# EAGLE design IP_m4_express (EAGLE 9.0.0)
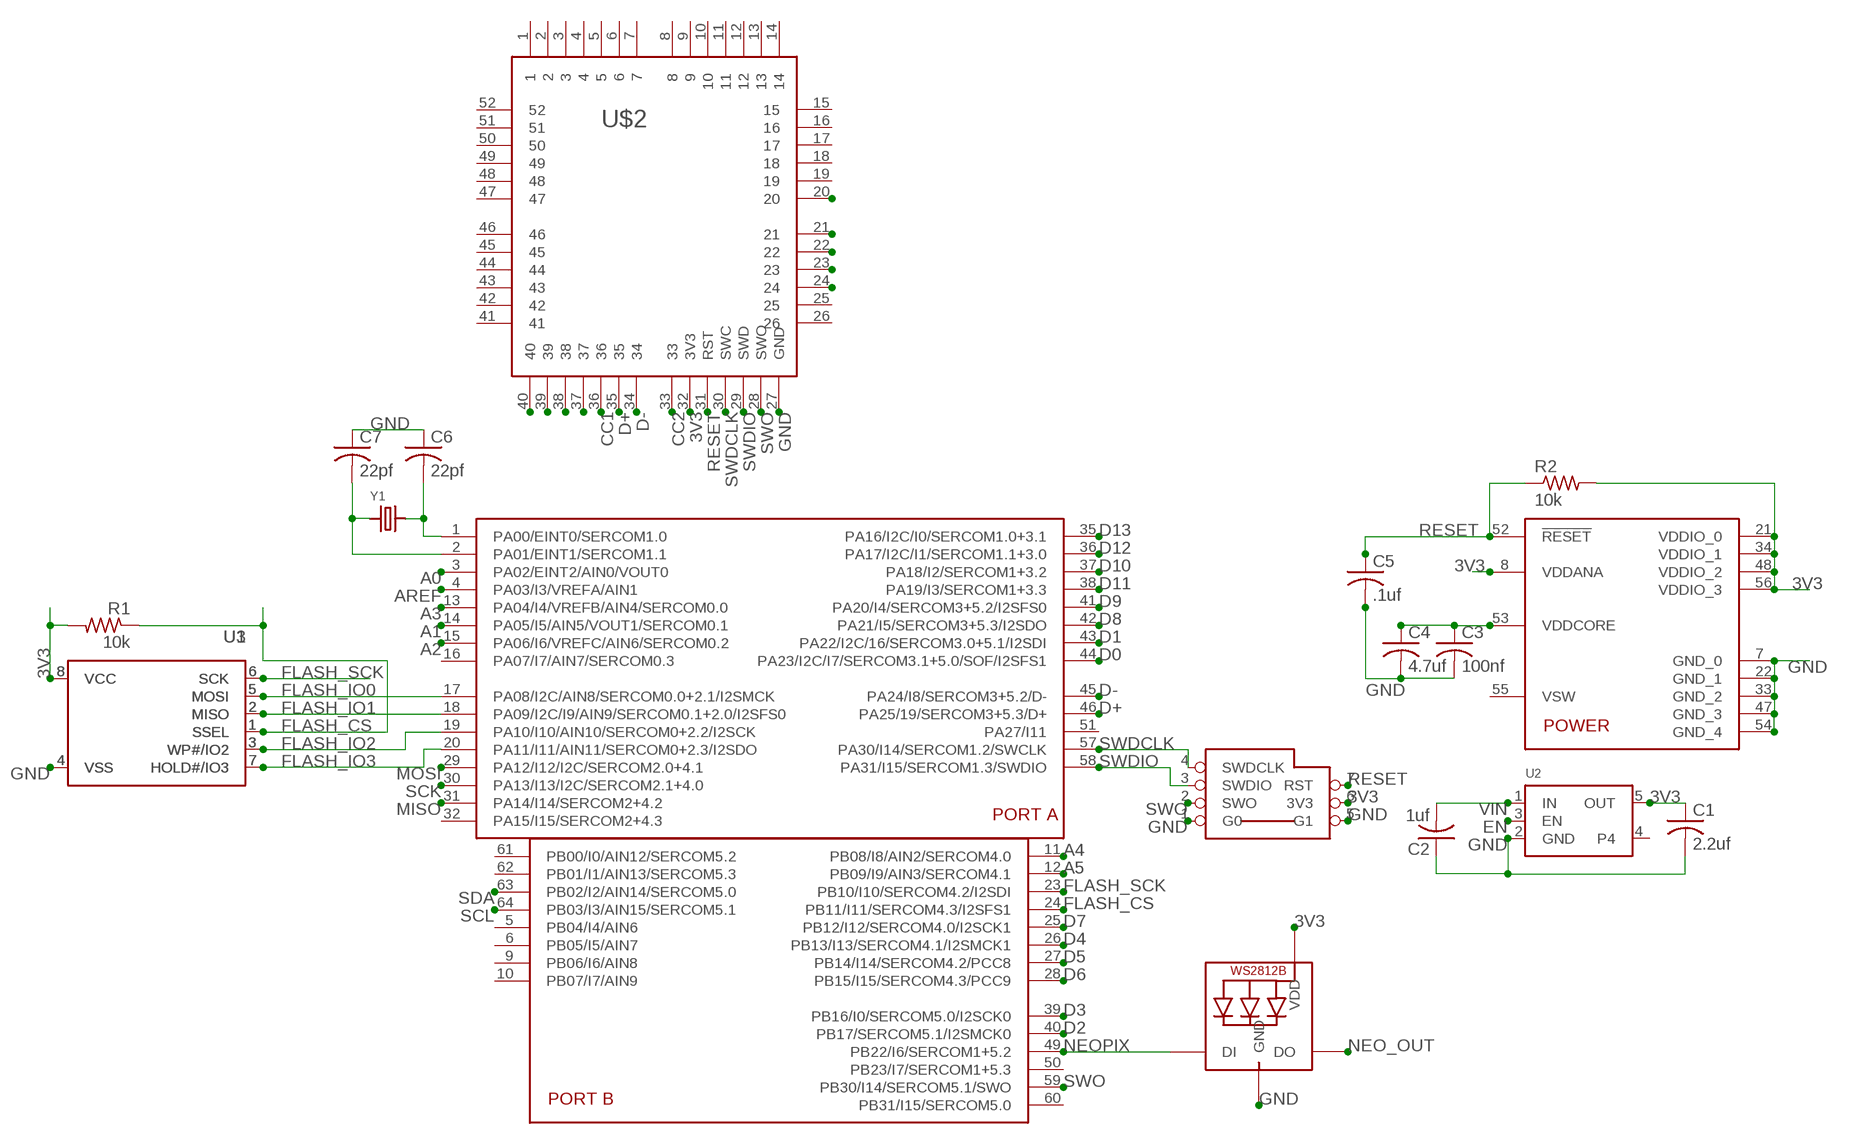
[diagram p0: schematic, sheet 1]

## Parts
C1  2.2uf  C-TG  [TG-C0805MP]
C2  1uf  C-TG  [TG-C0805MP]
C3  100nf  C-TG  [TG-C0805MP]
C4  4.7uf  C-TG  [TG-C0805MP]
C5  .1uf  C-TG  [TG-C0805MP]
C6  22pf  C-TG  [TG-C0805MP]
C7  22pf  C-TG  [TG-C0805MP]
LED1  LED-NEO-WS2812B3535  [LED3535]
R1  10k  R_TG  [TG-R0805]
R2  10k  R_TG  [TG-R0805]
U1  FLASH-SPI-SOIC8  [SOIC8_150MIL]
U2  VREG_STD_MIN_SOT23-5  [SOT23-5]
U3  FLASH-SPI-SOIC8208MIL  [SOIC8_208MIL]
U$1  MCU-ATSAMD51J-ADATQFP  [QFP50P1200X1200X120-64N]
U$2  DL_IP-52PACKAGE  [DL_IP-52_2MM-25X30-PACKAGE]
U$3  SWD_POGO  [SWD_POGO]
Y1  XTAL_ADA4.9X1.8  [MICROBUILDER_CRYSTAL_4.9X1.8]

## Nets
3V3: C1.1 LED1.2(VDD) R1.2 R2.2 U1.8(VCC) U2.5(OUT) U3.8(VCC) U$1.8(VDDANA) U$1.21(VDDIO_0) U$1.34(VDDIO_1) U$1.48(VDDIO_2) U$1.56(VDDIO_3) U$2.24 U$2.32(3V3) U$3.6(3V3)
A0: U$1.3(PA02/EINT2/AIN0/VOUT0)
A1: U$1.14(PA05/I5/AIN5/VOUT1/SERCOM0.1)
A2: U$1.15(PA06/I6/VREFC/AIN6/SERCOM0.2)
A3: U$1.13(PA04/I4/VREFB/AIN4/SERCOM0.0)
A4: U$1.11(PB08/I8/AIN2/SERCOM4.0)
A5: U$1.12(PB09/I9/AIN3/SERCOM4.1)
AREF: U$1.4(PA03/I3/VREFA/AIN1)
CC1: U$2.36
CC2: U$2.33
D0: U$1.44(PA23/I2C/I7/SERCOM3.1+5.0/SOF/I2SFS1)
D1: U$1.43(PA22/I2C/16/SERCOM3.0+5.1/I2SDI)
D2: U$1.40(PB17/SERCOM5.1/I2SMCK0)
D3: U$1.39(PB16/I0/SERCOM5.0/I2SCK0)
D4: U$1.26(PB13/I13/SERCOM4.1/I2SMCK1)
D5: U$1.27(PB14/I14/SERCOM4.2/PCC8)
D6: U$1.28(PB15/I15/SERCOM4.3/PCC9)
D7: U$1.25(PB12/I12/SERCOM4.0/I2SCK1)
D8: U$1.42(PA21/I5/SERCOM3+5.3/I2SDO)
D9: U$1.41(PA20/I4/SERCOM3+5.2/I2SFS0)
D10: U$1.37(PA18/I2/SERCOM1+3.2)
D11: U$1.38(PA19/I3/SERCOM1+3.3)
D12: U$1.36(PA17/I2C/I1/SERCOM1.1+3.0)
D13: U$1.35(PA16/I2C/I0/SERCOM1.0+3.1)
D+: U$1.46(PA25/19/SERCOM3+5.3/D+) U$2.35
D-: U$1.45(PA24/I8/SERCOM3+5.2/D-) U$2.34
EN: U2.3(EN)
FLASH_CS: R1.1 U1.1(SSEL) U3.1(SSEL) U$1.24(PB11/I11/SERCOM4.3/I2SFS1)
FLASH_IO0: U1.5(MOSI) U3.5(MOSI) U$1.17(PA08/I2C/AIN8/SERCOM0.0+2.1/I2SMCK)
FLASH_IO1: U1.2(MISO) U3.2(MISO) U$1.18(PA09/I2C/I9/AIN9/SERCOM0.1+2.0/I2SFS0)
FLASH_IO2: U1.3(WP#/IO2) U3.3(WP#/IO2) U$1.19(PA10/I10/AIN10/SERCOM0+2.2/I2SCK)
FLASH_IO3: U1.7(HOLD#/IO3) U3.7(HOLD#/IO3) U$1.20(PA11/I11/AIN11/SERCOM0+2.3/I2SDO)
FLASH_SCK: U1.6(SCK) U3.6(SCK) U$1.23(PB10/I10/SERCOM4.2/I2SDI)
GND: C1.2 C2.1 C3.2 C4.2 C5.2 C6.1 C7.1 LED1.4(GND) U1.4(VSS) U2.2(GND) U3.4(VSS) U$1.7(GND_0) U$1.22(GND_1) U$1.33(GND_2) U$1.47(GND_3) U$1.54(GND_4) U$2.27(GND) U$3.1(G0) U$3.5(G1)
MISO: U$1.31(PA14/I14/SERCOM2+4.2)
MOSI: U$1.29(PA12/I12/I2C/SERCOM2.0+4.1)
N$1: U$2.40
N$2: C7.2 U$1.2(PA01/EINT1/SERCOM1.1) Y1.1
N$3: C6.2 U$1.1(PA00/EINT0/SERCOM1.0) Y1.2
N$4: U$2.23
N$5: U$2.22
N$6: U$2.21
N$7: U$2.20
N$8: U$2.39
N$9: U$2.38
N$11: U$2.37
NEO_OUT: LED1.3(DO)
NEOPIX: LED1.1(DI) U$1.49(PB22/I6/SERCOM1+5.2)
RESET: C5.1 R2.1 U$1.52(!RESET) U$2.31(RST) U$3.7(RST)
SCK: U$1.30(PA13/I13/I2C/SERCOM2.1+4.0)
SCL: U$1.64(PB03/I3/AIN15/SERCOM5.1)
SDA: U$1.63(PB02/I2/AIN14/SERCOM5.0)
SWDCLK: U$1.57(PA30/I14/SERCOM1.2/SWCLK) U$2.30(SWC) U$3.4(SWDCLK)
SWDIO: U$1.58(PA31/I15/SERCOM1.3/SWDIO) U$2.29(SWD) U$3.3(SWDIO)
SWO: U$1.59(PB30/I14/SERCOM5.1/SWO) U$2.28(SWO) U$3.2(SWO)
VCORE: C3.1 C4.1 U$1.53(VDDCORE)
VIN: C2.2 U2.1(IN)
Unconnected: U2.4 U$1.5(PB04/I4/AIN6) U$1.6(PB05/I5/AIN7) U$1.9(PB06/I6/AIN8) U$1.10(PB07/I7/AIN9) U$1.16(PA07/I7/AIN7/SERCOM0.3) U$1.32(PA15/I15/SERCOM2+4.3) U$1.50(PB23/I7/SERCOM1+5.3) U$1.51(PA27/I11) U$1.55(VSW) U$1.60(PB31/I15/SERCOM5.0) U$1.61(PB00/I0/AIN12/SERCOM5.2) U$1.62(PB01/I1/AIN13/SERCOM5.3) U$2.1 U$2.2 U$2.3 U$2.4 U$2.5 U$2.6 U$2.7 U$2.8 U$2.9 U$2.10 U$2.11 U$2.12 U$2.13 U$2.14 U$2.15 U$2.16 U$2.17 U$2.18 U$2.19 U$2.25 U$2.26 U$2.41 U$2.42 U$2.43 U$2.44 U$2.45 U$2.46 U$2.47 U$2.48 U$2.49 U$2.50 U$2.51 U$2.52

## Library data of the parts
C1-C7 = 0TG-Lib v01.3:C-TG
LED1 = 0TG-Lib v01.3:LED-NEO-WS2812B: from: adafruit
R1 R2 = 0TG-Lib v01.3:R_TG
U1 U3 = 0TG-Lib v01.3:FLASH-SPI-SOIC8: SOIC8 SPI Flash Be careful with the size since SOIC8 flash comes in several 'widths' SOIC8 150 mil M25P16 - 16Mbit (2Mbit x 8) Serial Flash (75MHz SPI Bus), Supply: 2.7-3.6V Digikey: SOIC8 - M25P16-VMN6P-ND SOIC8 208 mil W25Q16BVSSIG - 16Mbit (2Mbit x 8) Serial Flash (104MHz SPI Bus), Supply: 2.7-3.6V Digikey: SOIC8 - W25Q16BVSSIG-ND from: adafruit availability low
U2 = 0TG-Lib v01.3:VREG_STD_MIN_SOT23-5: SOT23-5 Fixed Voltage Regulators from: adafruit Part Current Out V Out V In V Dropout θJA (°C/W) TJ (°C) Digikey Part No. ADP121 150mA 3.3V 3.4-5.5V 0.09V @ 150mA -- -- ADP121-AUJZ33R7CT-ND ADP121 150mA 3.0V 3.1-5.5V 0.09V @ 150mA -- -- ADP121-AUJZ30R7CT-ND ADP122 300mA 3.3V 3.4-5.5V 0.085V @ 300mA -- -- ADP122AUJZ-3.3-R7CT-ND ADP1712 300mA 3.3V 3.5-5.5V 0.17V @ 300mA -- -- ADP1712AUJZ-3.3-R7TR-ND AP7311 (Low Cost) 150mA 3.3V 3.5-6V 0.15V @ 150mA -- -- AP7311-33WG-7DICT-ND LD39015M18R 150mA 1.8V 1.9V-5.5V 0.08V @ 100mA -- -- 497-6977-1-ND LP2985A-33DBVR 150mA 3.3V 3.3-16V 0.28V @ 150mA 206 150 296-18479-1-ND MCP1824T-3302E/OT 300mA 3.3V 3.5V-6V 0.2V @ 300mA -- -- MCP1824T-3302E/OTCT-ND MIC5205-2.5YM5 TR 150mA 2.5V 2.7-16V 0.165V @ 150mA -- -- 576-1257-2-ND MIC5205-3.0YM5 TR 150mA 3.0V 3.2V-16V 0.165V @ 150mA -- -- 576-1258-2-ND MIC5205-3.3YM5 TR 150mA 3.3V 3.5V-16V 0.165V @ 150mA -- -- 576-1259-2-ND TPS780330220 150mA 3.3V+2.2V 3.6-5.5V 250mV Max -- -- 296-23332-1-ND TDA3663/N1,135 100mA 3.3V 3.5-45V 0.18V @ 50mA -- -- 568-5343-1-ND Max operating temp can be calculated using θJA, TJ (max junction temperature), and power in watts. Set the "Maximum Ambient Temperature" until it reaches TJ ("Max Junction Temperature"), which is the absolute limit for safe use of the regulator: Heat Sink Temperature Calculator <http://www.daycounter.com/Calculators/Heat-Sink-Temperature-Calculator.phtml> For example, With 12V source into a 3.3V LP2985 and a 30mA load, we are dissipating (12V-3.3V) * 0.03A = 0.261W. With a θJA of 206 °C/W, a TJ of 150°C, and 261mW we can safely use the chip without a heat sink up to 75°C (=147.1°C Junction Temperature).
U$1 = 0TG-Lib v01.3:MCU-ATSAMD51J-ADA: ATSAMD51J cortex m4 microcontroller from: adafruit altered: TG-Techie
U$2 = 0TG-Lib v01.3:DL_IP-52
U$3 = board packages dev:SWD_POGO
Y1 = 0TG-Lib v01.3:XTAL_ADA: Crystals HC49UP - Surface Mount Crystal 4.0MHz 18pF +/-30ppm Surface Mount Crystal [Digikey: 535-9857-1-ND] 12.0 MHz Surface Mount Crystal [Digikey: 535-9869-6-ND] 25.0 MHz Surface Mount Crystal [Digikey: 535-9078-1-ND] 2.5 x 2.0mm - MEMs SMT Crystal 16.0 MHz 10pF 20ppm 2.5 x 2.0mm Crystal [Digikey -40-85°C: 535-10923-1-ND] 3.2 x 2.5mm - MEMs SMT Crystal 12.0 MHz 8pF 15ppm 3.2 x 2.5mm Crystal [Digikey: -10-70°C: 644-1047-1-ND -40-125°C: 644-1128-1-ND] 16.0 MHz 8pF 15ppm 3.2 x 2.5mm Crystal [Digikey: -10-70°C: 644-1049-1-ND -40-125°C: 644-1129-2-ND] 16.0 MHz 10pF 10ppm 3.2 x 2.5mm Crystal [Digikey: 644-1100-1-ND] 27.12 MHz 18pF 30ppm 3.2 x 2.5mm Crystal [Digikey: 887-1424-1-ND] 27.12MHz 10pF 10ppm 3.2 x 2.5mm Crystal [Digikey: 887-1329-1-ND] 4.9 x 1.8mm - MEMs SMT Crystal 32.768 KHz 12.5pF 20ppm 4.9 x 1.8mm Crystal [Digikey: SE2415CT-ND] 8.0 x 3.8mm - Surface Mount Crystal 32.768kHz 12.5pF 20ppm -40°C-85°C [Digikey: 535-9166-2-ND] Cylinder 32.768KHz Cylinder Crystal (2x6mm body) [Ex. Digikey: 300-8341-2-ND]

## Board
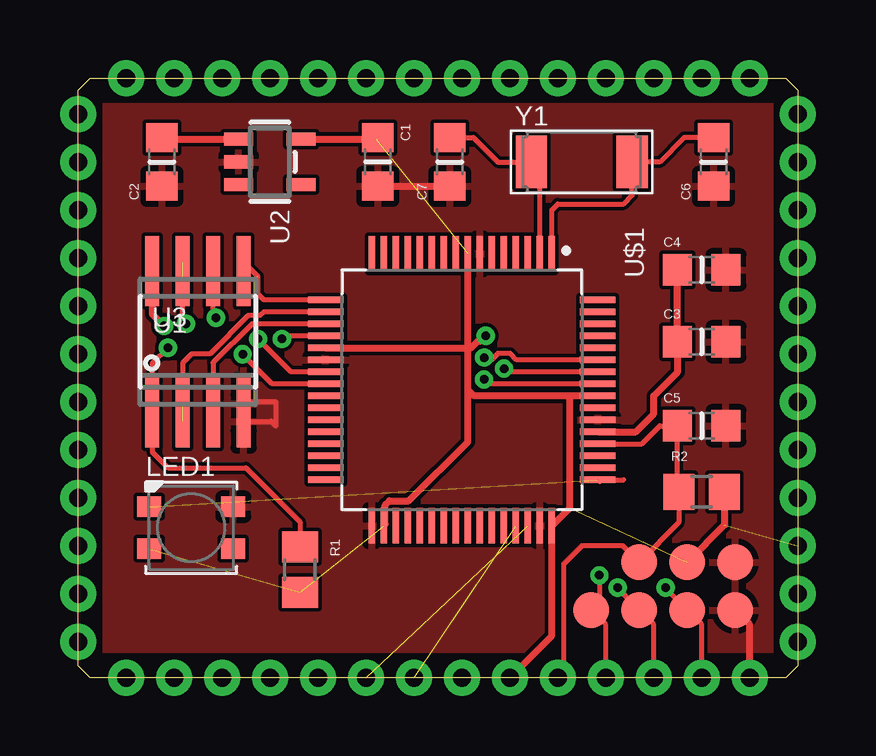
[diagram p1: board, top side]
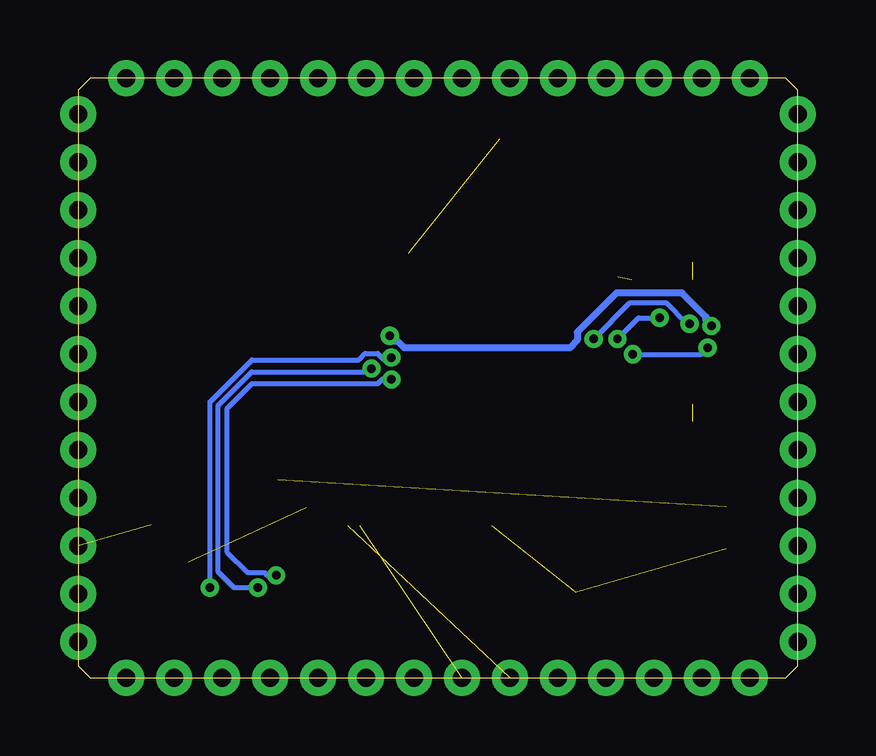
[diagram p2: board, bottom side, seen from below]

Size 30 x 25 mm. Coordinates in mm from the lower left corner, seen from the top.
Copper layers (1*16): Top 0.035mm / dielectric 1.5mm / Bottom 0.035mm
Design rules "default": minimum track width 6mil, minimum drill 0.35mm, track to track 6mil, track to pad 6mil, pad to pad 6mil, via to via 6mil, smd to smd 6mil, copper to edge 40mil, drill to drill 6mil, minimum pad ring 10mil, minimum via ring 8mil, stop-mask expansion 4mil, vias tented up to drill 0mil, thermal gap 10mil

### Footprints (pad centres in the part's own frame; a part is rotated, then mirrored left to right if it is on the bottom)
TG-C0805MP = smd 1.2 x 1.3: 1 -1.016,0; 2 1.016,0
LED3535 = smd 1 x 0.85: 1 -1.75,0.875; 2 -1.75,-0.875; 3 1.75,-0.875; 4 1.75,0.875
TG-R0805 = smd 1.3 x 1.5: 1 -0.95,0; 2 0.95,0
SOIC8_150MIL = smd 0.6 x 2.2: 1 -1.905,-2.6; 2 -0.635,-2.6; 3 0.635,-2.6; 4 1.905,-2.6; 5 1.905,2.6; 6 0.635,2.6; 7 -0.635,2.6; 8 -1.905,2.6
SOT23-5 = smd 0.55 x 1.2: 1 -0.95,-1.3; 2 0,-1.3; 3 0.95,-1.3; 4 0.95,1.3; 5 -0.95,1.3
SOIC8_208MIL = smd 0.6 x 2.2: 1 -1.905,-3.315; 2 -0.635,-3.315; 3 0.635,-3.315; 4 1.905,-3.315; 5 1.905,3.315; 6 0.635,3.315; 7 -0.635,3.315; 8 -1.905,3.315
QFP50P1200X1200X120-64N = smd 1.47 x 0.28: 1 -5.67,3.75; 2 -5.67,3.25; 3 -5.67,2.75; 4 -5.67,2.25; 5 -5.67,1.75; 6 -5.67,1.25; 7 -5.67,0.75; 8 -5.67,0.25; 9 -5.67,-0.25; 10 -5.67,-0.75; 11 -5.67,-1.25; 12 -5.67,-1.75; 13 -5.67,-2.25; 14 -5.67,-2.75; 15 -5.67,-3.25; 16 -5.67,-3.75; 33 5.67,-3.75; 34 5.67,-3.25; 35 5.67,-2.75; 36 5.67,-2.25; 37 5.67,-1.75; 38 5.67,-1.25; 39 5.67,-0.75; 40 5.67,-0.25; 41 5.67,0.25; 42 5.67,0.75; 43 5.67,1.25; 44 5.67,1.75; 45 5.67,2.25; 46 5.67,2.75; 47 5.67,3.25; 48 5.67,3.75 | smd 0.28 x 1.47: 17 -3.75,-5.67; 18 -3.25,-5.67; 19 -2.75,-5.67; 20 -2.25,-5.67; 21 -1.75,-5.67; 22 -1.25,-5.67; 23 -0.75,-5.67; 24 -0.25,-5.67; 25 0.25,-5.67; 26 0.75,-5.67; 27 1.25,-5.67; 28 1.75,-5.67; 29 2.25,-5.67; 30 2.75,-5.67; 31 3.25,-5.67; 32 3.75,-5.67; 49 3.75,5.67; 50 3.25,5.67; 51 2.75,5.67; 52 2.25,5.67; 53 1.75,5.67; 54 1.25,5.67; 55 0.75,5.67; 56 0.25,5.67; 57 -0.25,5.67; 58 -0.75,5.67; 59 -1.25,5.67; 60 -1.75,5.67; 61 -2.25,5.67; 62 -2.75,5.67; 63 -3.25,5.67; 64 -3.75,5.67
DL_IP-52_2MM-25X30-PACKAGE = drill 0.75 pad 1.5: 1 -13,12.5; 2 -11,12.5; 3 -9,12.5; 4 -7,12.5; 5 -5,12.5; 6 -3,12.5; 7 -1,12.5; 8 1,12.5; 9 3,12.5; 10 5,12.5; 11 7,12.5; 12 9,12.5; 13 11,12.5; 14 13,12.5; 15 15,11; 16 15,9; 17 15,7; 18 15,5; 19 15,3; 20 15,1; 21 15,-1; 22 15,-3; 23 15,-5; 24 15,-7; 25 15,-9; 26 15,-11; 27 13,-12.5; 28 11,-12.5; 29 9,-12.5; 30 7,-12.5; 31 5,-12.5; 32 3,-12.5; 33 1,-12.5; 34 -1,-12.5; 35 -3,-12.5; 36 -5,-12.5; 37 -7,-12.5; 38 -9,-12.5; 39 -11,-12.5; 40 -13,-12.5; 41 -15,-11; 42 -15,-9; 43 -15,-7; 44 -15,-5; 45 -15,-3; 46 -15,-1; 47 -15,1; 48 -15,3; 49 -15,5; 50 -15,7; 51 -15,9; 52 -15,11
SWD_POGO = smd 1.5 x 1.5: 1 -1,-2; 2 -1,0; 3 -1,2; 4 -1,4; 5 1,-2; 6 1,0; 7 1,2
MICROBUILDER_CRYSTAL_4.9X1.8 = smd 1.3 x 2.2: 1 -2.1,0; 2 2.1,0

### Placement (x,y rotation side)
C1  12.5,21.5 270 top
C2  3.5,21.5 90 top
C3  26,14 0 top
C4  26,17 0 top
C5  26,10.5 0 top
C6  26.5,21.5 90 top
C7  15.5,21.5 90 top
LED1  4.72,6.25 0 top
R1  9.25,4.5 270 top
R2  26,7.75 0 top
U1  5,14 0 top
U2  8,21.5 270 top
U3  5,14 0 top
U$1  16,12 270 top
U$2  15,12.5 0 top
U$3  25.4,3.81 90 top
Y1  21,21.5 0 top

### Tracks (layer width: path | path; a pad name or v marks a point on that pad's centre or on a via)
3V3  (via drill 0.35)  (5 unrouted)
  Top 0.225: U3.8 U1.8
  Top 0.3: U2.5 12.43,22.45 C1.1 | U$1.56 20.5,11.75 | 20.5,11.75 16.5,11.75 16.25,12 | 16.25,12 16.25,12.5 16.25,13.75 | 16.25,13.75 U$1.8 | U$1.21 16.25,13.75 | 20.5,11.75 20.5,7.08 U$1.48 19.75,1.75 U$2.32 | R2.2 26.95,6.36 U$3.6 | U1.8 3.1,15.15 v3.59,14.66 | v17,14.25 16.77,14.02 16.66,14.02 16.39,13.75 16.25,13.75 | 16.25,12 16.25,9.83 13.79,7.37 12.98,7.37 12.81,7.19 12.81,6.39 U$1.34
  Bottom 0.3: v3.59,14.66 3.82,14.89 3.82,15.03 4.82,16.03 7.55,16.03 9.18,14.4 9.18,14.07 9.5,13.75 16.39,13.75 16.66,14.02 16.77,14.02 v17,14.25
D+  (1 unrouted)
D-  (1 unrouted)
FLASH_CS  (via drill 0.35)
  Top 0.2: U$1.24 8.1,12.25 v6.87,13.48 | v3.75,13.75 3.1,13.1 U1.1 | U3.1 3.1,9.4 3.75,8.75 7,8.75 9.25,6.5 R1.1
  Top 0.225: U3.1 U1.1
  Bottom 0.2: v6.87,13.48 4.02,13.48 v3.75,13.75
FLASH_IO0  (1 unrouted)
  Top 0.2: U$1.17 7.75,15.75 7.5,16 7.5,16.72 U3.5
FLASH_IO1  (1 unrouted)
  Top 0.2: U3.2 4.37,13.12 4.75,13.5 5.5,13.5 7.1,15.1 7.6,15.1 7.75,15.25 U$1.18
FLASH_IO2
  Top 0.2: U$1.19 7.25,14.75 5.63,13.13 U3.3
  Top 0.225: U3.3 U1.3
FLASH_IO3  (via drill 0.35)  (1 unrouted)
  Top 0.2: U$1.20 8.63,14.25 v8.5,14.12 | v4.5,14.75 4.37,14.88 U1.7
  Bottom 0.2: v4.5,14.75 4.61,14.75 5.49,15.63 6.99,15.63 v8.5,14.12
FLASH_SCK  (via drill 0.35)
  Top 0.2: U$1.23 8.88,12.75 v7.51,14.12 | v5.75,15 5.63,15.12 U1.6
  Top 0.225: U3.6 U1.6
  Bottom 0.2: v7.51,14.12 6.63,15 v5.75,15
GND
  Top 0.2: U3.4 8.06,10.69 8.25,10.5 8.25,11.5 7,11.5 U1.4
  Top 0.3: C1.2 C7.1 | U$2.27 28,2.21 U$3.1
  pour Top: -1.5,26.25 33,26.25 33,-1.75 -1.75,-1.75 -1.75,26.25
N$2
  Top 0.2: U$1.2 19.25,21.15 Y1.1 17.5,21.5 16.48,22.52 C7.2
N$3
  Top 0.2: U$1.1 19.75,19.5 20,19.75 22.75,19.75 23.1,20.1 Y1.2 24.25,21.5 25.27,22.52 C6.2
NEOPIX  (1 unrouted)
  Top 0.2: 21.75,8.17 U$1.49 22.75,8.25
RESET
  Top 0.2: U$1.52 23.5,9.75 24.25,10.5 C5.1 24.98,7.82 R2.1 25.05,6.46 U$3.7 22.71,5.5 21,5.5 20.25,4.75 20.25,0.25 U$2.31
  Top 0.3: 24.98,7.75 R2.1
SWDCLK  (via drill 0.35)
  Top 0.2: U$1.57 17.11,12.25 v16.93,12.43 | v21.73,4.27 21.73,3.14 U$3.4 22,2.21 U$2.30
  Bottom 0.2: v16.93,12.43 17.32,12.43 17.5,12.25 22.75,12.25 23.8,11.21 23.8,5.25 22.93,4.38 22.24,4.38 22.13,4.27 v21.73,4.27
SWDIO  (via drill 0.35)
  Top 0.2: U$1.58 17.9,12.75 v17.77,12.88 | v22.5,3.75 22.5,3.71 23.36,2.85 U$3.3 24,2.21 U$2.29
  Bottom 0.2: v22.5,3.75 23.5,3.75 24.15,4.4 24.15,11.35 22.75,12.75 17.9,12.75 v17.77,12.88
SWO  (via drill 0.35)
  Top 0.2: v16.94,13.34 17.03,13.25 17.24,13.25 17.5,13.51 18.03,13.51 18.29,13.25 U$1.59 | v24.5,3.75 24.5,3.71 U$3.2 26,2.21 U$2.28
  Bottom 0.2: v24.5,3.75 24.5,11.5 22.75,13.25 18.29,13.25 18.03,13.51 17.5,13.51 17.26,13.27 17.01,13.27 v16.94,13.34
VCORE
  Top 0.3: C4.1 C3.1 25,13.98 25,12.75 24,11.75 24,11 23.25,10.25 U$1.53
VIN
  Top 0.3: C2.2 3.57,22.45 U2.1